# EAGLE design xl4432 (EAGLE 9.6.2)
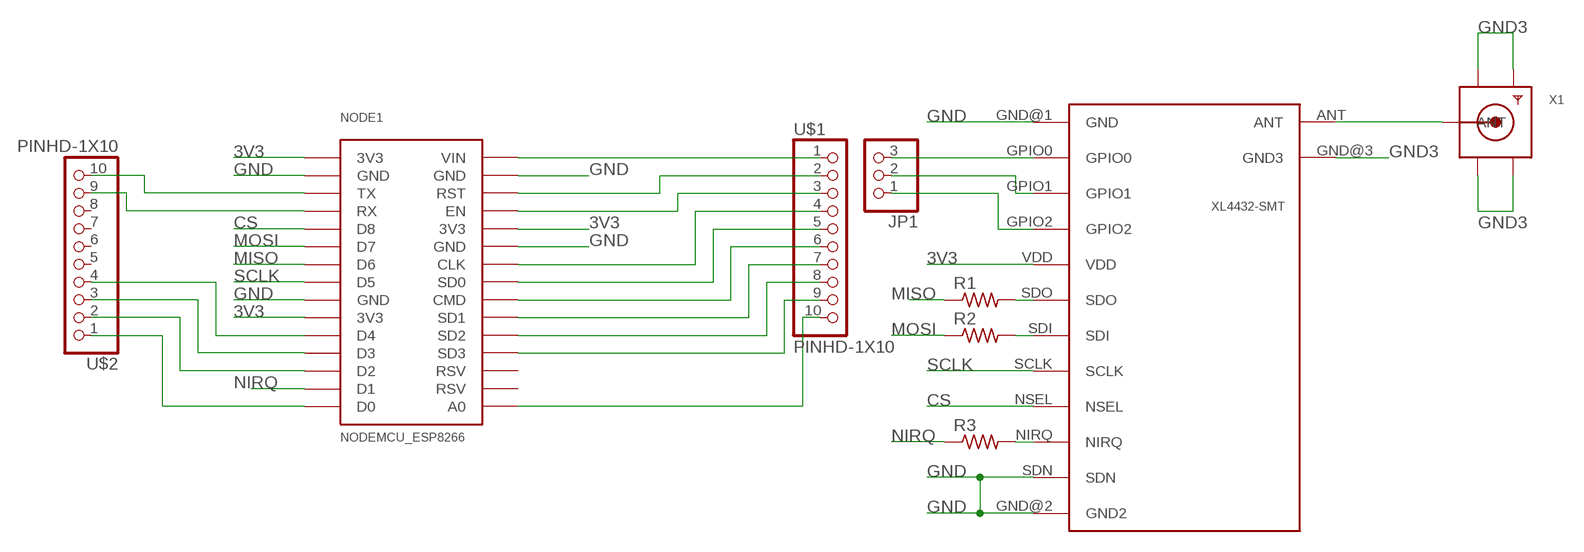
[diagram p0: schematic, sheet 1]

## Parts
4332-1  XM4432-SMT  [XL4432-SMT]
JP1  PINHD-1X3  [1X03]
NODE1  NODEMCU_ESP8266  [NODEMCU_ESP8266]
R1  R-US_R2012  [R2012]
R2  R-US_R2012  [R2012]
R3  R-US_R2012  [R2012]
U$1  PINHD-1X10  [1X10-BIG]
U$2  PINHD-1X10  [1X10-BIG]
X1  SMACONNECTOR  [SMA90_DIP]

## Nets
3V3: 4332-1.VDD NODE1.3V3@1(3V3) NODE1.3V3@2(3V3) NODE1.3V3@3(3V3)
CS: 4332-1.NSEL NODE1.D8
GND: 4332-1.GND@1(GND) 4332-1.GND@2(GND2) 4332-1.SDN NODE1.GND@1(GND) NODE1.GND@2(GND) NODE1.GND@3(GND) NODE1.GND@4(GND)
GND3: 4332-1.GND@3(GND3) X1.GND1 X1.GND2 X1.GND3 X1.GND4
MISO: NODE1.D6 R1.1
MOSI: NODE1.D7 R2.1
N$1 [RF]: 4332-1.ANT X1.ANTENNA(ANT)
N$3: 4332-1.GPIO0 JP1.3
N$4: 4332-1.GPIO1 JP1.2
N$5: 4332-1.GPIO2 JP1.1
N$6: NODE1.VIN U$1.1
N$7: NODE1.RST U$1.2
N$8: NODE1.EN U$1.3
N$9: NODE1.CLK U$1.4
N$10: NODE1.SDO(SD0) U$1.5
N$11: NODE1.CMD U$1.6
N$12: NODE1.SD1 U$1.7
N$13: NODE1.SD2 U$1.8
N$14: NODE1.SD3 U$1.9
N$15: NODE1.A0 U$1.10
N$16: NODE1.TX U$2.10
N$17: NODE1.RX U$2.9
N$18: NODE1.D0 U$2.1
N$19: NODE1.D2 U$2.2
N$20: NODE1.D3 U$2.3
N$21: NODE1.D4 U$2.4
N$23: 4332-1.SDO R1.2
N$24: 4332-1.SDI R2.2
N$25: 4332-1.NIRQ R3.2
NIRQ: NODE1.D1 R3.1
SCLK: 4332-1.SCLK NODE1.D5
Unconnected: NODE1.RSV1(RSV) NODE1.RSV2(RSV) U$2.5 U$2.6 U$2.7 U$2.8

## Library data of the parts
4332-1 = xl4432-smt:XM4432-SMT: XL4432-SMT Si4432 based transceiver Drawn by Will Cooke. Made available under the GPL. For full licence details please see the github page or read any copy of the GPL v2. Datasheet available here:http://www.silabs.com/Support%20Documents/TechnicalDocs/Si4430-31-32.pdf www.whizzy.org https://github.com/8none1 @8none1 <https://twitter.com/8none1>
JP1 = adafruit:PINHD-1X3: PIN HEADER
NODE1 = nodemcu_esp8266:NODEMCU_ESP8266: Node MCU V2 (ESP8266) Created by Harish
R1-R3 = adafruit:R-US_: RESISTOR, American symbol
U$1 U$2 = adafruit:PINHD-1X10: Pin header 1x10 0.1" spacing With round pins
X1 = adafruit:SMACONNECTOR: SMA Connector 90° DIP SMA Connector, 50 Ohm (4UConnector: 07259)

## Board
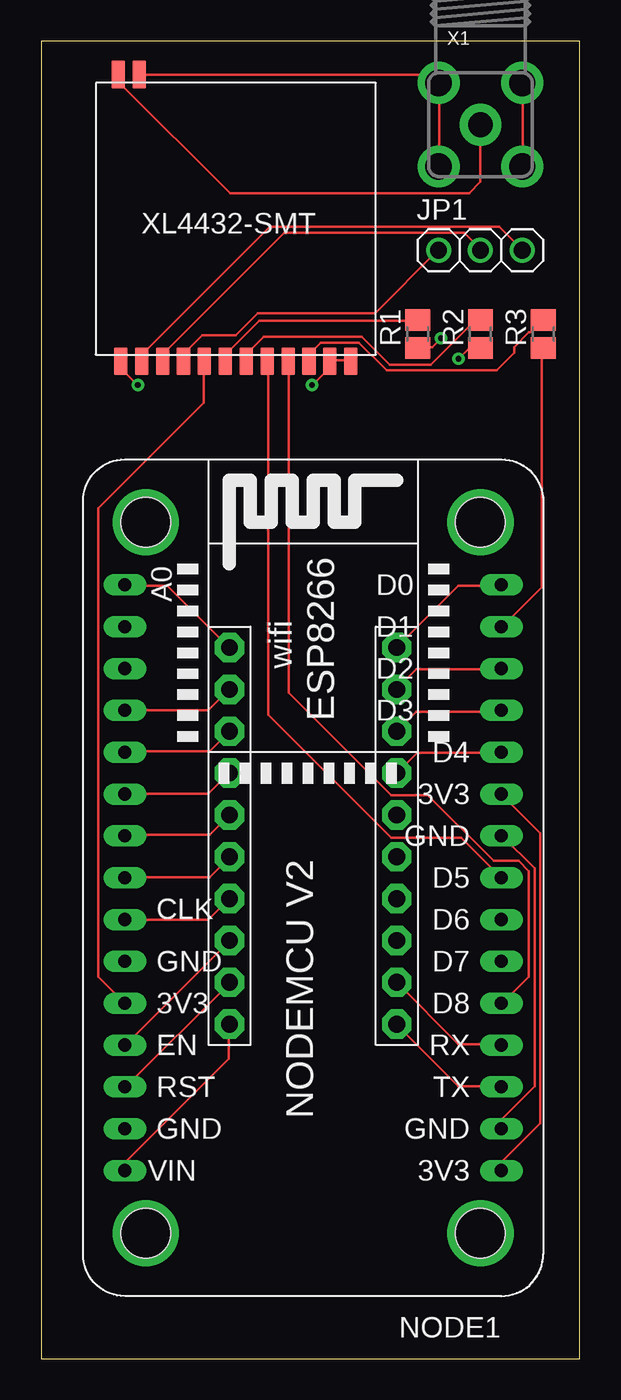
[diagram p1: board, top side]
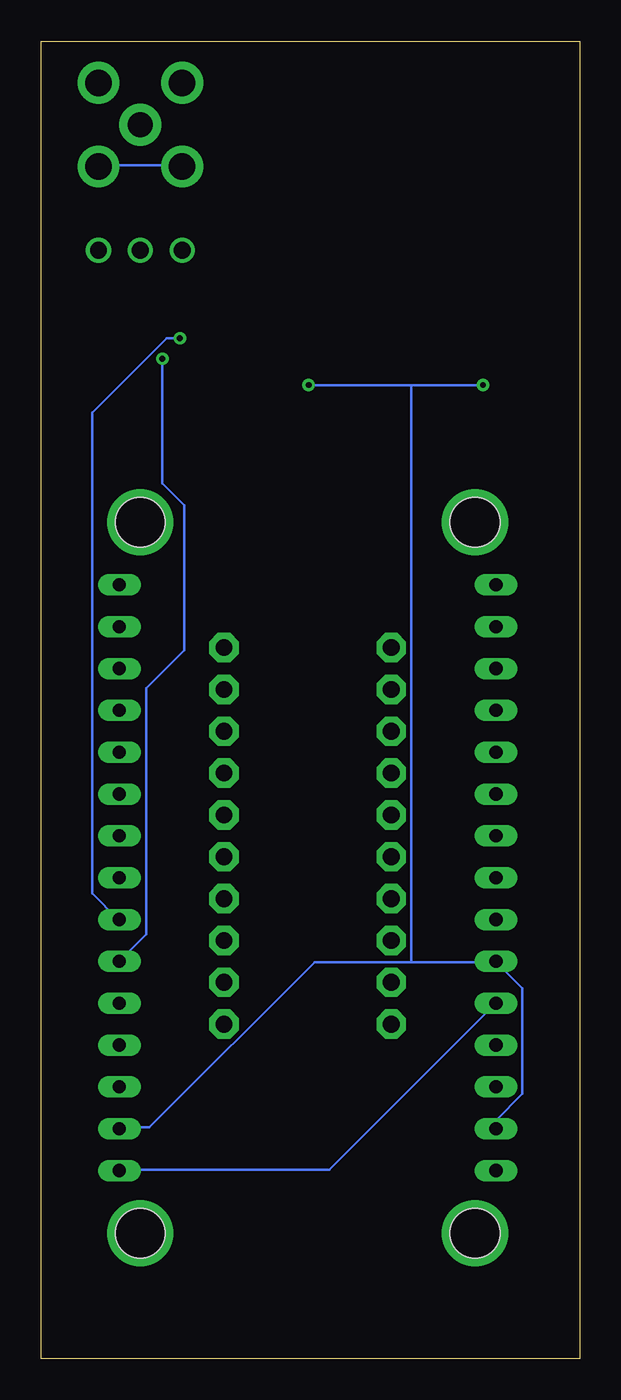
[diagram p2: board, bottom side, seen from below]

Size 32.69 x 80 mm. Coordinates in mm from the lower left corner, seen from the top.
Outline: 0,0 32.69,0 32.69,80 0,80 0,0
Copper layers (1*16): Top 0.035mm / dielectric 1.5mm / Bottom 0.035mm
Design rules "default *": minimum track width 6mil, minimum drill 0.35mm, track to track 8mil, track to pad 8mil, pad to pad 8mil, via to via 8mil, smd to smd 8mil, copper to edge 40mil, drill to drill 6mil, minimum pad ring 10mil, minimum via ring 8mil, stop-mask expansion 4mil, vias tented up to drill 0mil, thermal gap 10mil

### Footprints (pad centres in the part's own frame; a part is rotated, then mirrored left to right if it is on the bottom)
XL4432-SMT = smd 0.813 x 1.676: ANT 15.63,-0.5; GND@1 15.49,16.9; GND@2 1.52,16.9; GND@3 14.36,-0.5; GPIO0 14.22,16.9; GPIO1 12.95,16.9; GPIO2 11.68,16.9; NIRQ 4.06,16.9; NSEL 5.33,16.9; SCLK 6.6,16.9; SDI 7.87,16.9; SDN 2.79,16.9; SDO 9.14,16.9; VDD 10.41,16.9
1X03 = drill 1.016: 1 -2.54,0; 2 0,0; 3 2.54,0
NODEMCU_ESP8266 = drill 0.8 long: 3V3@1 -11.43,19.05; 3V3@2 -11.43,-3.81; 3V3@3 11.43,8.89; A0 11.43,-16.51; CLK 11.43,3.81; CMD 11.43,-1.27; D0 -11.43,-16.51; D1 -11.43,-13.97; D2 -11.43,-11.43; D3 -11.43,-8.89; D4 -11.43,-6.35; D5 -11.43,1.27; D6 -11.43,3.81; D7 -11.43,6.35; D8 -11.43,8.89; EN 11.43,11.43; GND@1 -11.43,16.51; GND@2 -11.43,-1.27; GND@3 11.43,6.35; GND@4 11.43,16.51; RST 11.43,13.97; RSV1 11.43,-11.43; RSV2 11.43,-13.97; RX -11.43,11.43; SD1 11.43,-3.81; SD2 11.43,-6.35; SD3 11.43,-8.89; SDO 11.43,1.27; TX -11.43,13.97; VIN 11.43,19.05 | drill 3: P$31 10.16,22.86; P$32 -10.16,22.86; P$33 -10.16,-20.32; P$34 10.16,-20.32 | hole 3: 10.16,22.86; 10.16,-20.32; -10.16,-20.32; -10.16,22.86
R2012 = smd 1.3 x 1.5: 1 -0.85,0; 2 0.85,0
1X10-BIG = drill 1.016 pad 1.778 octagon: 1 -11.43,0; 2 -8.89,0; 3 -6.35,0; 4 -3.81,0; 5 -1.27,0; 6 1.27,0; 7 3.81,0; 8 6.35,0; 9 8.89,0; 10 11.43,0
SMA90_DIP = drill 1.5 pad 2.54: ANTENNA 0,0 | drill 1.6 pad 2.54: GND1 -2.54,2.54; GND2 2.54,2.54; GND3 -2.54,-2.54; GND4 2.54,-2.54

### Placement (x,y rotation side)
4332-1  20.32,77.47 180 top
JP1  26.67,67.31 0 top
NODE1  16.51,30.48 180 top
R1  22.86,62.23 90 top
R2  26.67,62.23 90 top
R3  30.48,62.23 90 top
U$1  11.43,31.75 90 top
U$2  21.59,31.75 270 top
X1  26.67,74.93 0 top

### Tracks (layer width: path | path; a pad name or v marks a point on that pad's centre or on a via)
3V3
  Top 0.152: NODE1.3V3@2 30.32,31.91 30.32,14.31 28,12 28,11.47 NODE1.3V3@1 | NODE1.3V3@3 3.47,23.2 3.47,51.65 9.87,58.05 9.87,60.54 4332-1.VDD
  Bottom 0.152: NODE1.3V3@3 15.2,11.47 27.91,11.47 NODE1.3V3@1
CS
  Top 0.152: 4332-1.NSEL 15.02,60.54 15.02,40.45 21.25,34.23 23.47,34.23 27.47,30.23 28.98,30.23 29.6,29.6 29.6,23.2 28,21.6 NODE1.D8
GND  (via drill 0.35)
  Top 0.152: v5.87,59.12 4.89,60.1 4.89,60.54 4332-1.GND@1 | v16.45,59.12 17.51,60.19 17.51,60.54 4332-1.SDN 17.6,60.63 18.76,60.63 4332-1.GND@2 | NODE1.GND@1 28,14.05 28,14.58 29.96,16.54 29.96,29.78 28,31.74 NODE1.GND@2
  Bottom 0.152: v16.45,59.12 10.22,59.12 | 10.22,59.12 v5.87,59.12 | NODE1.GND@4 5.07,14.05 5.07,14.49 3.47,16.09 3.47,22.49 5.07,24.09 NODE1.GND@3 5.16,24.09 10.22,24.09 | 10.22,24.09 16.09,24.09 26.14,14.05 27.91,14.05 NODE1.GND@1 | 10.22,24.09 10.22,59.12
GND3
  Top 0.152: X1.GND4 29.25,72.45 29.25,77.43 X1.GND2 | 4332-1.GND@3 6.04,77.97 23.65,77.97 24.09,77.52 X1.GND1 24.18,77.43 24.18,72.45 X1.GND3
  Bottom 0.152: X1.GND4 29.16,72.45 24.18,72.45 X1.GND3
MISO  (via drill 0.35)
  Top 0.152: v24.27,61.96 23.74,61.43 22.94,61.43 R1.1
  Bottom 0.152: v24.27,61.96 25.07,61.96 29.6,57.43 29.6,28.27 28,26.67 NODE1.D6
MOSI  (via drill 0.35)
  Top 0.152: v25.34,60.72 25.96,61.34 26.67,61.34 R2.1
  Bottom 0.152: v25.34,60.72 25.34,53.16 24,51.83 24,43.03 26.31,40.72 26.31,25.78 27.91,24.18 NODE1.D7
N$1
  Top 0.152: X1.ANTENNA 26.67,71.45 25.98,70.76 11.47,70.76 4.71,77.52 4.71,77.97 4332-1.ANT
N$3
  Top 0.152: 4332-1.GPIO0 6.13,60.63 6.13,60.98 13.87,68.72 27.83,68.72 29.16,67.39 JP1.3
N$4
  Top 0.152: 4332-1.GPIO1 7.38,60.63 7.38,60.98 14.76,68.36 25.69,68.36 26.67,67.39 JP1.2
N$5
  Top 0.152: 4332-1.GPIO2 8.71,60.63 8.71,61.07 9.78,62.14 11.82,62.14 13.16,63.48 20.27,63.48 24.09,67.3 JP1.1
N$6
  Top 0.152: NODE1.VIN 5.16,11.47 5.16,12 11.38,18.22 11.38,20.27 U$1.1
N$7
  Top 0.152: NODE1.RST 5.16,16.54 11.47,22.85 U$1.2
N$8
  Top 0.152: NODE1.EN 5.16,19.11 11.38,25.34 U$1.3
N$9
  Top 0.152: NODE1.CLK 10.13,26.67 11.38,27.91 U$1.4
N$10
  Top 0.152: NODE1.SDO 5.16,29.25 10.22,29.25 11.38,30.4 U$1.5
N$11
  Top 0.152: NODE1.CMD 5.16,31.83 10.22,31.83 11.38,32.98 U$1.6
N$12
  Top 0.152: NODE1.SD1 5.16,34.31 10.13,34.31 11.38,35.56 U$1.7
N$13
  Top 0.152: U$1.8 10.22,36.89 5.16,36.89 NODE1.SD2
N$14
  Top 0.152: NODE1.SD3 5.16,39.38 10.13,39.38 11.38,40.63 U$1.9
N$15
  Top 0.152: NODE1.A0 5.16,46.94 7.64,46.94 11.38,43.2 U$1.10
N$16
  Top 0.152: NODE1.TX 27.91,16.54 25.34,16.54 21.6,20.27 U$2.10
N$17
  Top 0.152: U$2.9 25.34,19.11 27.91,19.11 NODE1.RX
N$18
  Top 0.152: NODE1.D0 27.91,46.94 25.34,46.94 21.6,43.2 U$2.1
N$19
  Top 0.152: NODE1.D2 27.91,41.87 22.76,41.87 21.6,40.72 U$2.2
N$20
  Top 0.152: NODE1.D3 27.91,39.29 22.76,39.29 21.6,38.14 U$2.3
N$21
  Top 0.152: NODE1.D4 27.91,36.8 22.85,36.8 21.6,35.56 U$2.4
N$23
  Top 0.152: R1.2 22.85,63.03 13.25,63.03 11.2,60.98 11.2,60.63 4332-1.SDO
N$24
  Top 0.152: R2.2 26.67,63.03 26.31,63.03 23.65,60.36 21.16,60.36 19.47,62.05 13.51,62.05 12.54,61.07 12.54,60.63 4332-1.SDI
N$25
  Top 0.152: R3.2 30.4,63.03 29.69,62.32 29.6,62.32 28.71,61.43 28.71,61.07 27.65,60.01 20.98,60.01 19.29,61.7 16.98,61.7 16.27,60.98 16.27,60.63 4332-1.NIRQ
NIRQ
  Top 0.152: R3.1 30.4,61.34 30.4,46.85 28,44.45 NODE1.D1
SCLK
  Top 0.152: 4332-1.SCLK 13.78,60.54 13.78,39.12 21.25,31.65 25.51,31.65 27.91,29.25 NODE1.D5